# Altium schematic sheet Flash.SchDoc
size A3
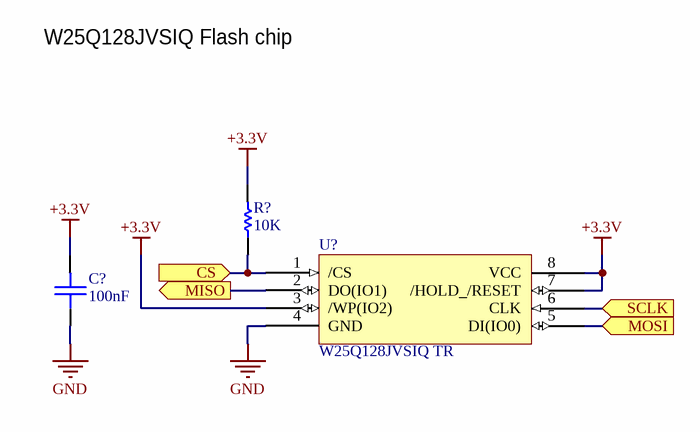
[diagram p0: Flash.SchDoc]

## Parts
C?  100nF  [0603_CAP]
R?  10K  [0603_RES]
U?  W25Q128JVSIQ TR  [SOIC_208MIL_WIN]

## Ports
CS (in), MISO (out), MOSI (in), SCLK (in)

## Nets
+3.3V: C?.1 R?.2 U?.3(/WP(IO2)) U?.7(/HOLD_/RESET) U?.8(VCC)
GND: C?.2 U?.4(GND)
CS: R?.1 U?.1(/CS) ; port CS
MISO: U?.2(DO(IO1)) ; port MISO
MOSI: U?.5(DI(IO0)) ; port MOSI
SCLK: U?.6(CLK) ; port SCLK

## Notes on the sheet
- W25Q128JVSIQ Flash chip
- Sheet title:
- Revision:
- Drawn by:
- Date:
- File:

## Library data of the parts
C? = Capacitor
R? = Resistor
U? = W25Q128JVSIQ TR: No Description Available; Vendor: Winbond; Built_By: EMA_Cory; SourceLibrary: Winbond_2020-02-06; Datasheet: https://www.winbond.com/resource-files/w25q128jv%20revf%2003272018%20plus.pdf; Manufacturer_Part_Number: W25Q128JVSIQ TR; Copyright: Copyright (C) 2018 Accelerated Designs. All rights reserved; RefDes: RefDes; Type: DEV